# EasyEDA Pro project ProPrj_CYT4BB7CE_2026-05-09.epro

# Board PCB1
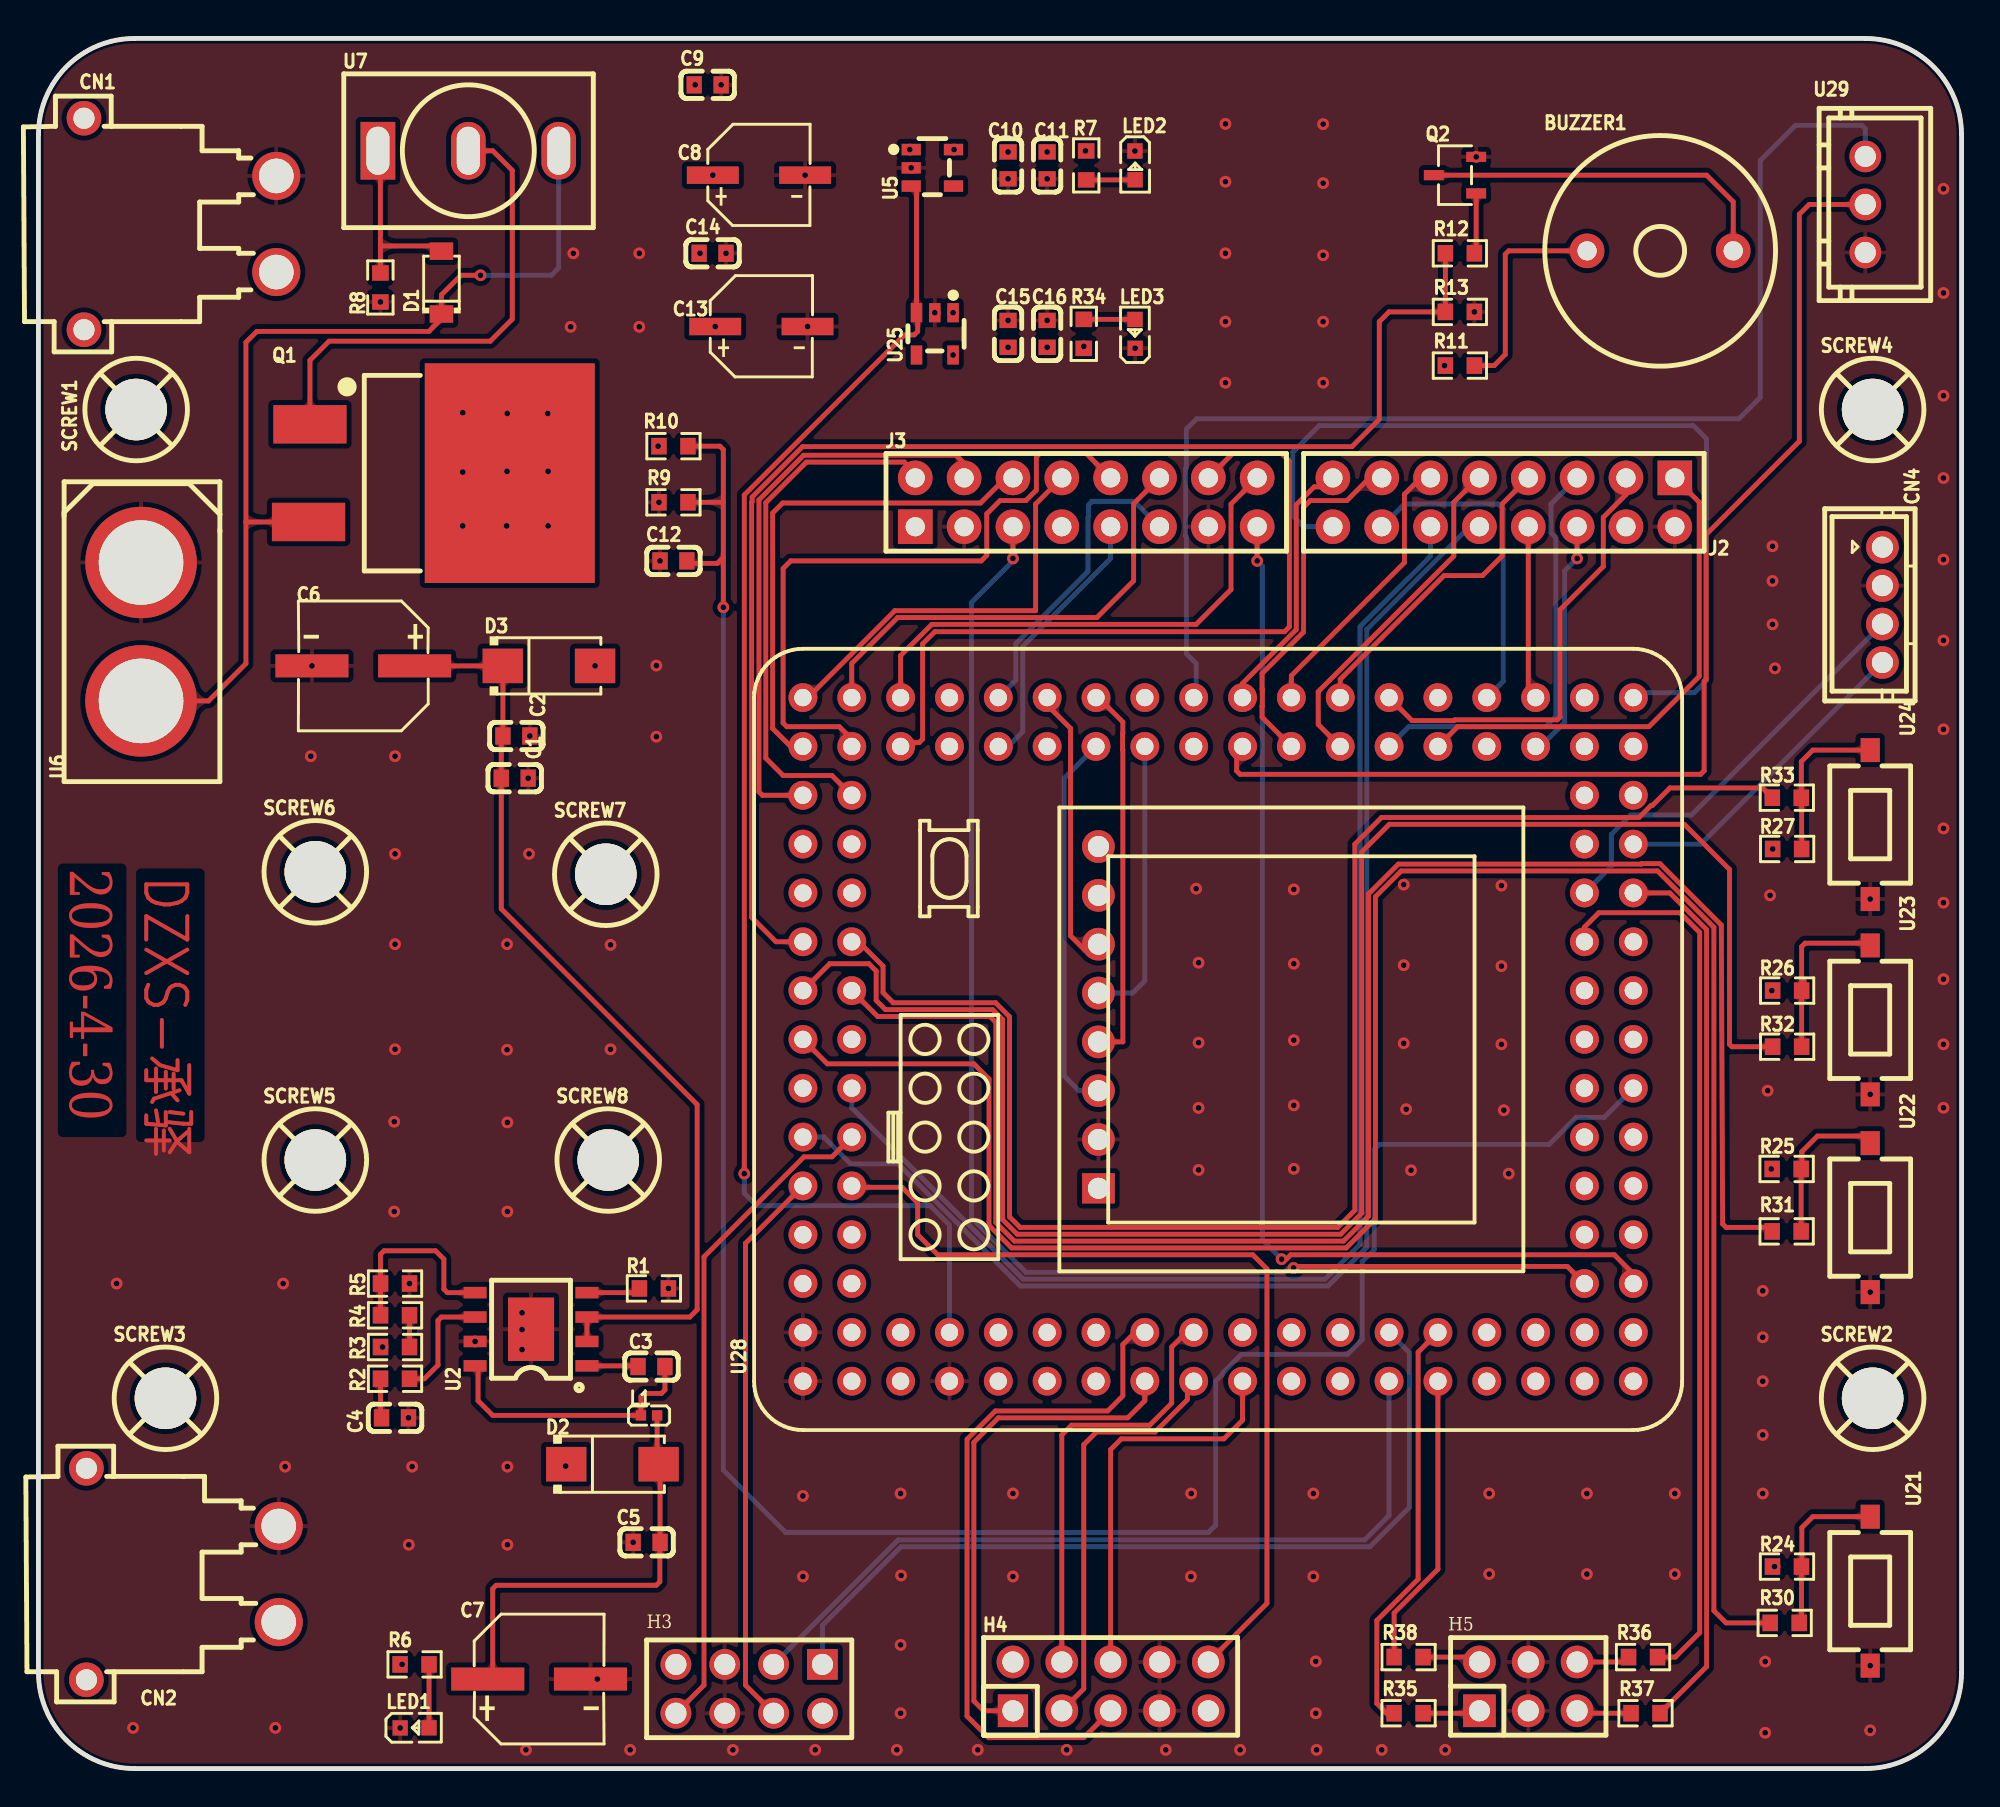
[diagram p0: board, top side]
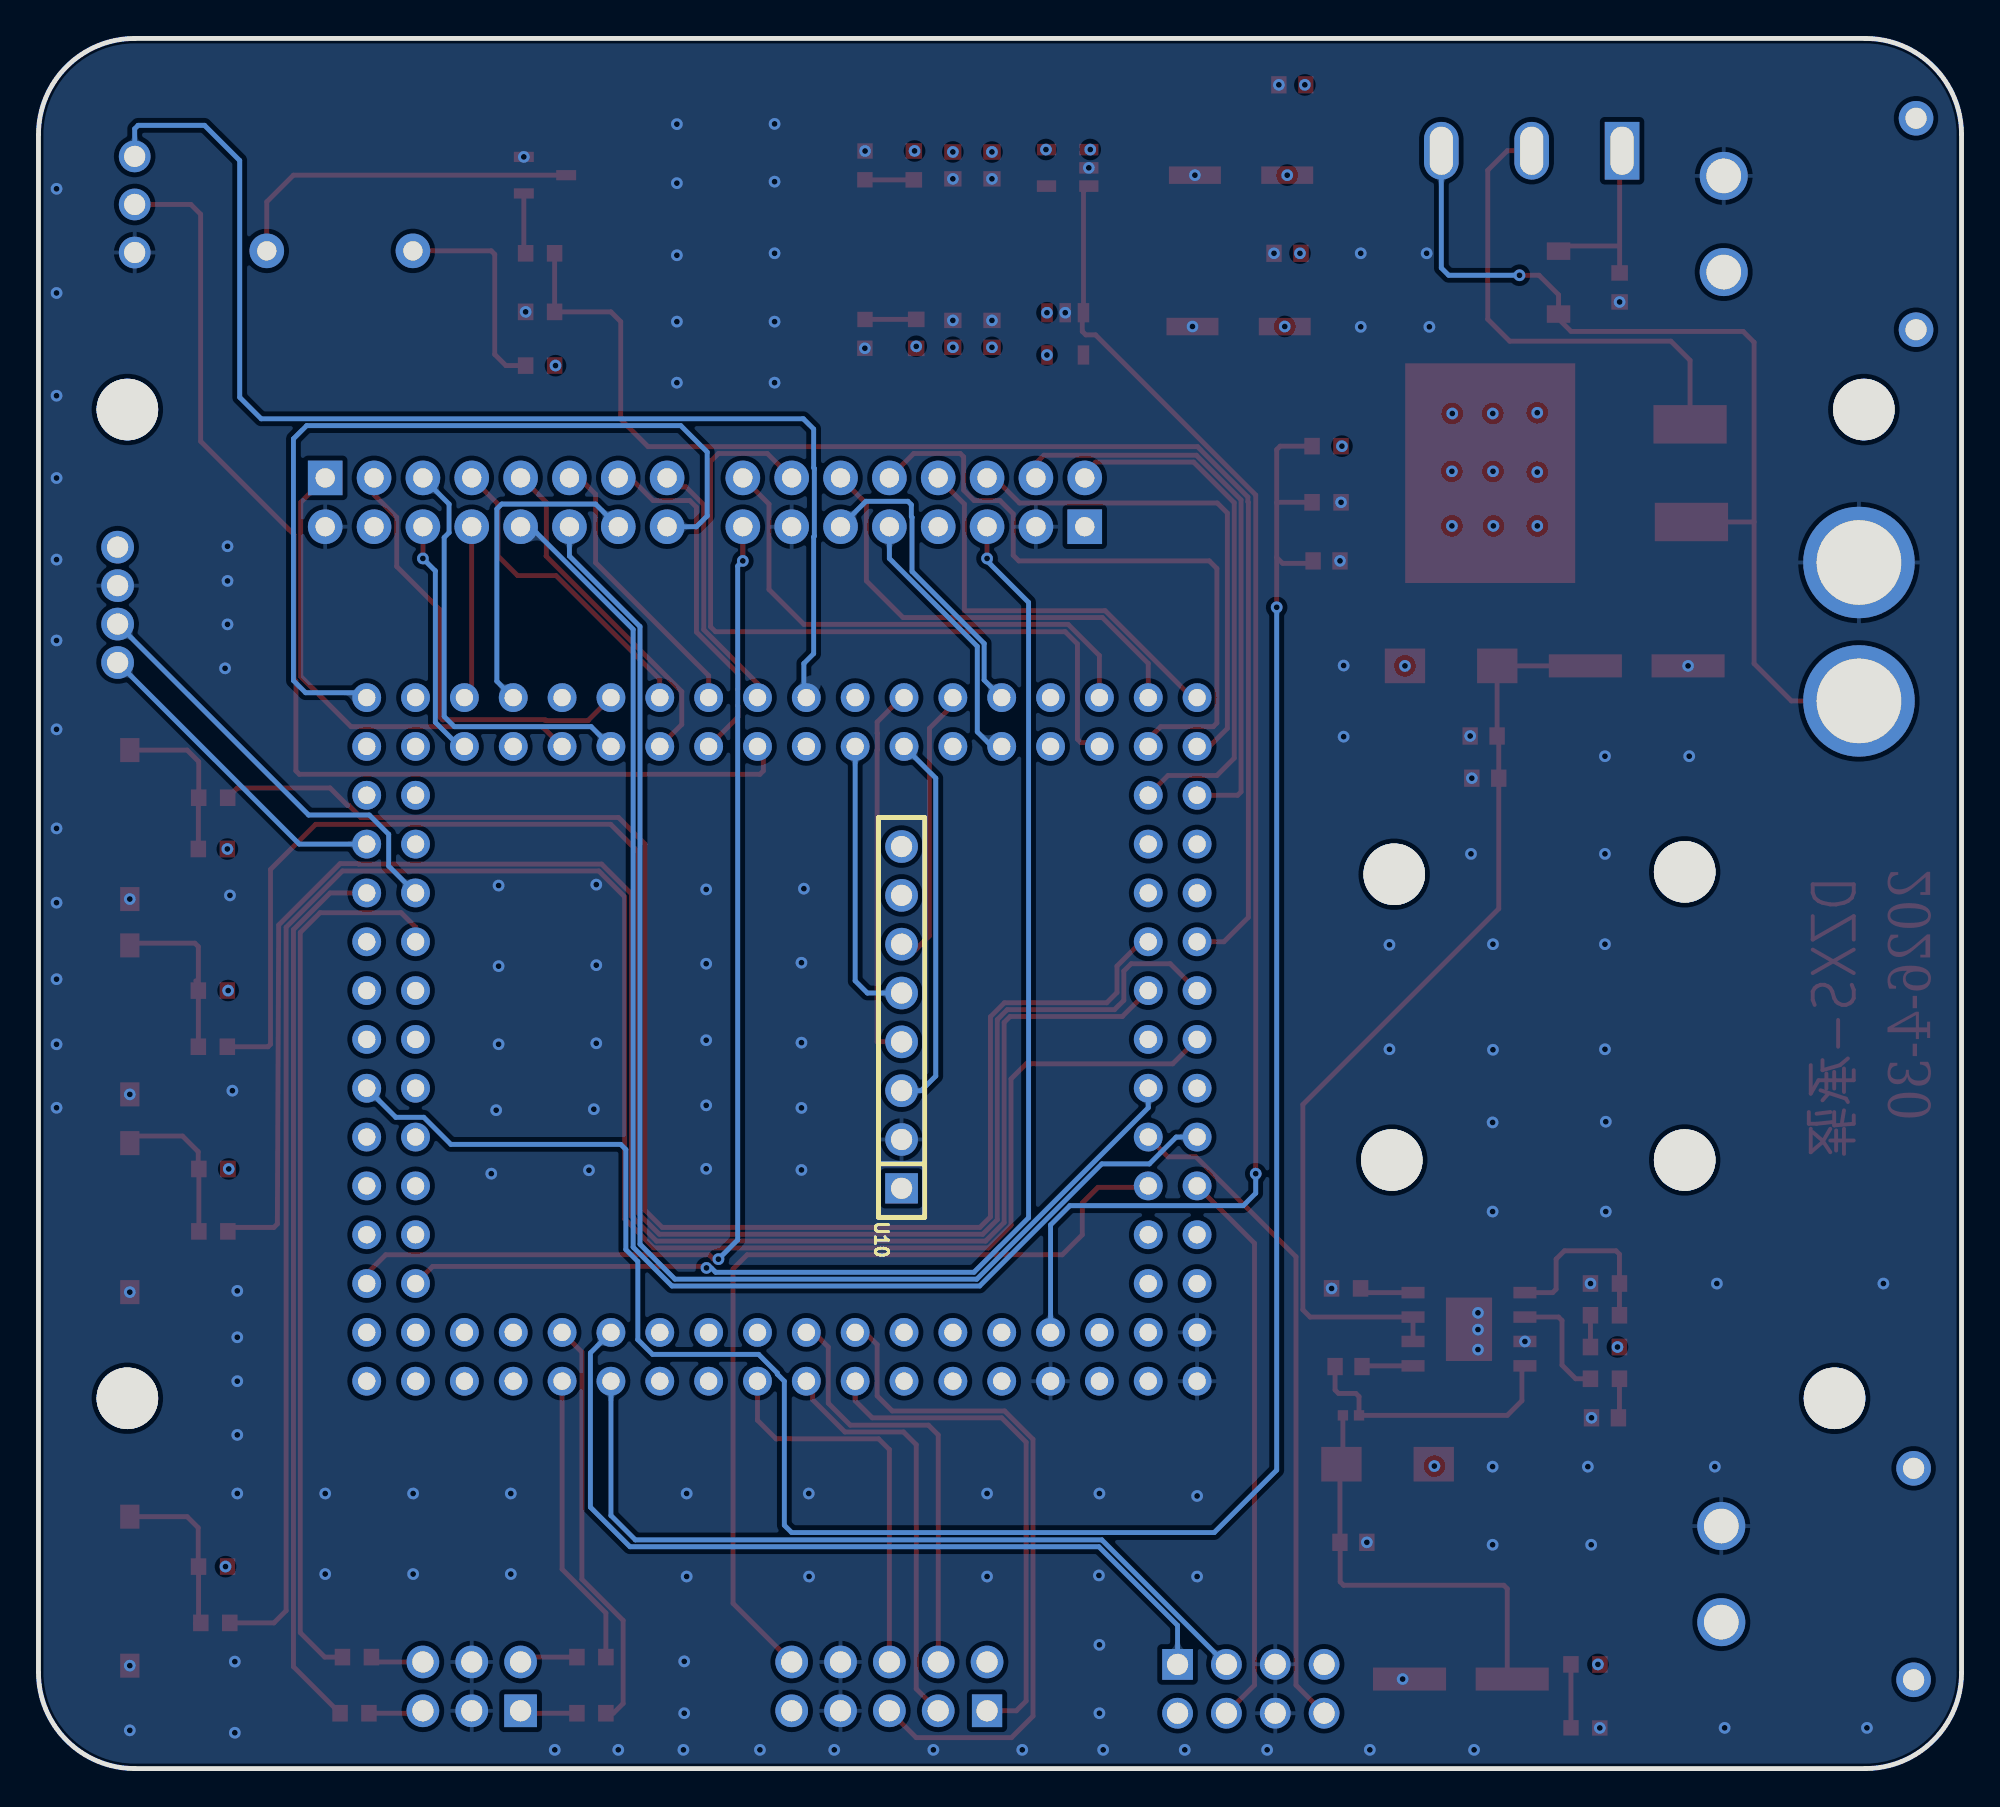
[diagram p1: board, bottom side, seen from below]

Outline 100 x 90 mm; copper layers: Top Layer, Inner1, Inner2, Bottom Layer. Coordinates in mm from the lower left corner of the outline.
Outline path: 0,85 0,5 arc(1.46,1.46) 5,0 95,0 arc(98.54,1.46) 100,5 100,85 arc(98.54,88.54) 95,90 5,90 arc(1.46,88.54) 0,85
Stack: Top Layer 0.035mm 外层铜厚1oz / Dielectric1 0.2104mm 7628 RC49% 8.6mil / Inner1 0.0152mm 内层铜厚 / Dielectric2 1.065mm 1.1mm H/HOZ Copper / Inner2 0.0152mm 内层铜厚 / Dielectric3 0.2104mm 7628 RC49% 8.6mil / Bottom Layer 0.035mm 外层铜厚1oz

## Design rules (mm)
template: JLCPCB Capability(Two Layers Board)
spacing copperThickness1oz (default): track to track 0.102, other pairs 0.152 to 0.3
spacing copperThickness2oz: track to track 0.203, other pairs 0.152 to 0.3
track width copperThickness1oz (default): min 0.127, default 0.254, max 2.54
track width copperThickness2oz: min 0.203, default 0.254, max 2.54
differential pair differentialPair (default): width min 0.127, default 0.254, max 2.54; gap min 0.152, default 0.152
via viaSize (default): diameter min 0.5, default 0.61, max 10; hole min 0.3, default 0.305, max 6.3

## Placement (name value [footprint] x y rotation side)
BUZZER1  2.3kHz  [BUZ-TH_BD12.0-P7.60-D0.6-FD]  84.33 78.95 0 top
C1  4.7uF  [C0603]  24.77 51.52 180 top
C2  100nF  [C0603]  24.85 53.71 180 top
C3  100nF  [C0603]  31.88 20.91 180 top
C4  4.7nF  [C0603]  18.54 18.25 0 top
C5  47uF  [C0603]  31.62 11.77 180 top
C6  100uF  [CAP-SMD_BD6.3-L6.6-W6.6-FD-1]  16.89 57.36 180 top
C7  220uF  [CAP-SMD_BD6.3-L6.6-W6.6-FD-1]  26.03 4.66 0 top
C8  10uF  [C_Ele_SMD_5x5.4mm]  37.47 82.89 0 top
C9  100nF  [C0603]  34.8 87.59 0 top
C10  10uF  [C0603]  50.42 83.4 270 top
C11  100nF  [C0603]  52.45 83.4 270 top
C12  100nF  [C0603]  33.02 62.82 0 top
C13  10uF  [C_Ele_SMD_5x5.4mm]  37.59 75.01 0 top
C14  100nF  [C0603]  35.05 78.82 0 top
C15  10uF  [C0603]  50.42 74.63 90 top
C16  100nF  [C0603]  52.45 74.63 90 top
CN1  XT30PW-M30.G.Y  [CONN-TH_XT30PW-M]  7.37 80.35 270 top
CN2  XT30PW-M30.G.Y  [CONN-TH_XT30PW-M]  7.49 10.12 270 top
CN4  WAFER-PH2.0-4PZZ  [CONN-TH_4P-P2.00_FWF20001-S04S22W5B]  95.88 60.54 270 top
D1  BZT52C16  [SOD-123_L2.7-W1.6-LS3.7-RD]  20.95 77.3 90 top
D2  SS54  [SMA_L4.2-W2.6-LS5.1-RD]  29.84 15.83 0 top
D3  SS54  [SMA_L4.2-W2.6-LS5.1-RD]  26.54 57.36 0 top
H3  DS1023-2*4SF11  [HDR-TH_8P-P2.54-V-F-R2-C4-S2.54]  36.96 4.15 180 top
H4  PM254V-12-10P-H85  [HDR-TH_10P-P2.54-V-F-R2-C5-S2.54]  55.75 4.28 0 top
H5  PZ254V-12-6P  [HDR-TH_6P-P2.54-V-M-R2-C3-S2.54]  77.47 4.28 0 top
J2  2.54-2*8P母  [HDR-TH_16P-P2.54-V-F-R2-C8-S2.54]  76.2 65.87 180 top
J3  2.54-2*8P母  [HDR-TH_16P-P2.54-V-F-R2-C8-S2.54]  54.48 65.87 0 top
L1  10uH  [L0402]  31.75 18.37 0 top
LED1  XL-1608UBC-04  [LED0603-RD_BLUE]  19.56 2.12 0 top
LED2  XL-1608UBC-04  [LED0603-RD_BLUE]  57.02 83.4 270 top
LED3  XL-1608UBC-04  [LED0603-RD_BLUE]  57.02 74.63 90 top
Q1  HY19P03B  [TO-263-2_L10.0-W9.1-P5.08-LS15.2-BR]  19.28 67.39 180 top
Q2  S8050  [SOT-23-3_L3.0-W1.7-P0.95-LS2.9-BR]  73.66 82.89 0 top
R1  200K  [R0603]  32 24.98 180 top
R2  20K  [R0603]  18.54 20.28 180 top
R3  51K  [R0603]  18.54 21.93 0 top
R4  1.5K  [R0603]  18.54 23.58 180 top
R5  10K  [R0603]  18.54 25.23 0 top
R6  4.7K  [R0603]  19.56 5.42 0 top
R7  2.7K  [R0603]  54.48 83.4 270 top
R8  10K  [R0603]  17.78 77.05 90 top
R9  20K  [R0603]  33.02 65.87 0 top
R10  200K  [R0603]  33.02 68.79 180 top
R11  10Ω  [R0603]  73.91 72.98 0 top
R12  4.7kΩ  [R0603]  73.91 78.82 0 top
R13  1kΩ  [R0603]  73.91 75.78 0 top
R24  4.7kΩ  [R0603]  90.92 10.51 0 top
R25  4.7kΩ  [R0603]  90.91 31.19 0 top
R26  4.7kΩ  [R0603]  90.93 40.47 0 top
R27  4.7kΩ  [R0603]  90.93 47.84 0 top
R30  470Ω  [R0603]  90.81 7.58 180 top
R31  470Ω  [R0603]  90.91 27.94 180 top
R32  470Ω  [R0603]  90.93 37.55 180 top
R33  470Ω  [R0603]  90.91 50.5 180 top
R34  2.7K  [R0603]  54.36 74.63 90 top
R35  100Ω  [R0603]  71.25 2.88 0 top
R36  100Ω  [R0603]  83.44 5.8 0 top
R37  100Ω  [R0603]  83.57 2.88 0 top
R38  100Ω  [R0603]  71.25 5.8 0 top
SCREW1  -  [M3螺丝]  5.08 70.7 0 top
SCREW2  -  [M3螺丝]  95.38 19.26 0 top
SCREW3  -  [M3螺丝]  6.6 19.26 0 top
SCREW4  -  [M3螺丝]  95.38 70.7 0 top
SCREW5  -  [M3螺丝]  14.4 31.66 0 top
SCREW6  -  [M3螺丝]  14.4 46.65 0 top
SCREW7  -  [M3螺丝]  29.5 46.52 0 top
SCREW8  -  [M3螺丝]  29.63 31.66 0 top
U2  SCT2450CQSTER  [ESOP-8_L4.9-W3.9-P1.27-LS6.0-BL-EP]  25.61 22.85 90 top
U5  RT9013-33GB-JSM  [SOT-23-5_L2.9-W1.6-P0.95-LS2.8-BR]  46.48 83.27 180 top
U6  XT60-M.  [CONN-TH_XT60]  5.33 59.14 270 top
U7  MT-0-102-A101-M200-RS  [SW-TH_MT-0-103-A101-M200-RS]  22.35 84.16 0 top
U10  PM254-1-08-Z-8.5  [HDR-TH_8P-P2.54-V-F]  55.12 39.07 90 bottom
U21  GT-TC060A-H025-L1  [SW-SMD_L6.1-W3.5-LS8.0]  95.25 9.23 270 top
U22  GT-TC060A-H025-L1  [SW-SMD_L6.1-W3.5-LS8.0]  95.25 28.66 270 top
U23  GT-TC060A-H025-L1  [SW-SMD_L6.1-W3.5-LS8.0]  95.25 38.95 270 top
U24  GT-TC060A-H025-L1  [SW-SMD_L6.1-W3.5-LS8.0]  95.25 49.11 270 top
U25  RT9013-33GB-JSM  [SOT-23-5_L2.9-W1.6-P0.95-LS2.8-BR]  46.61 74.63 90 top
U28  -  [CYT4BB7CEx_CoreBoard_V1.x]  65.15 37.93 90 top
U29  XH2.54-3P 直插  [CONN-TH_XH2.54-3P]  95 81.36 90 top

## Footprints (pads in the part's own frame, mm; a bottom-side part is the same pattern mirrored in y, then rotated)
BUZ-TH_BD12.0-P7.60-D0.6-FD
  round 1.8 hole 1: 1(-3.8,0) 2(3.8,0)
C0603
  rect 0.8x0.9 smd: 1(-0.7,0) 2(0.7,0)
C_Ele_SMD_5x5.4mm
  rect 2.7x0.91 smd: 1(-2.4,0) 2(2.4,0)
CAP-SMD_BD6.3-L6.6-W6.6-FD-1
  rect 3.8x1.2 smd: 1(-2.67,0) 2(2.67,0)
CONN-TH_4P-P2.00_FWF20001-S04S22W5B
  round 1.7 hole 1.1: 1(-3,0) 2(-1,0) 3(1,0) 4(3,0)
CONN-TH_XH2.54-3P
  round 1.65 hole 1.1: 1(-2.5,0) 2(0,0) 3(2.5,0)
CONN-TH_XT30PW-M
  round 2.5 hole 1.8: 1(-2.5,5) 2(2.5,5)
  round 1.8 hole 1.1: 3(5.5,-5) 4(-5.5,-5)
CONN-TH_XT60
  round 5.8 hole 4.4: 1(-3.6,0) 2(3.6,0)
CYT4BB7CEx_CoreBoard_V1.x
  round 1.5 hole 0.9: 1(-17.78,25.4) 2(-15.24,25.4) 3(-17.78,22.86) 4(-15.24,22.86) 5(-17.78,20.32) 6(-15.24,20.32) 7(-17.78,17.78) 8(-15.24,17.78) 9(-17.78,15.24) 10(-15.24,15.24) 11(-17.78,12.7) 12(-15.24,12.7) 13(-17.78,10.16) 14(-15.24,10.16) 15(-17.78,7.62) 16(-15.24,7.62) 17(-17.78,5.08) 18(-15.24,5.08) 19(-17.78,2.54) 20(-15.24,2.54) 21(-17.78,0) 22(-15.24,0) 23(-17.78,-2.54) 24(-15.24,-2.54) 25(-17.78,-5.08) 26(-15.24,-5.08) 27(-17.78,-7.62) 28(-15.24,-7.62) 29(-17.78,-10.16) 30(-15.24,-10.16) 31(-17.78,-12.7) 32(-15.24,-12.7) 33(-17.78,-15.24) 34(-15.24,-15.24) 35(-17.78,-17.78) 36(-15.24,-17.78) 37(-12.7,-17.78) 38(-12.7,-15.24) 39(-10.16,-17.78) 40(-10.16,-15.24) 41(-7.62,-17.78) 42(-7.62,-15.24) 43(-5.08,-17.78) 44(-5.08,-15.24) 45(-2.54,-17.78) 46(-2.54,-15.24) 47(0,-17.78) 48(0,-15.24) 49(2.54,-17.78) 50(2.54,-15.24) 51(5.08,-17.78) 52(5.08,-15.24) 53(7.62,-17.78) 54(7.62,-15.24) 55(10.16,-17.78) 56(10.16,-15.24) 57(12.7,-17.78) 58(12.7,-15.24) 59(17.78,-17.78) 60(15.24,-17.78) 61(17.78,-15.24) 62(15.24,-15.24) 63(17.78,-12.7) 64(15.24,-12.7) 65(17.78,-10.16) 66(15.24,-10.16) 67(17.78,-7.62) 68(15.24,-7.62) 69(17.78,-5.08) 70(15.24,-5.08) 71(17.78,-2.54) 72(15.24,-2.54) 73(17.78,0) 74(15.24,0) 75(17.78,2.54) 76(15.24,2.54) 77(17.78,5.08) 78(15.24,5.08) 79(17.78,7.62) 80(15.24,7.62) 81(17.78,10.16) 82(15.24,10.16) 83(17.78,12.7) 84(15.24,12.7) 85(17.78,15.24) 86(15.24,15.24) 87(17.78,17.78) 88(15.24,17.78) 89(17.78,20.32) 90(15.24,20.32) 91(17.78,22.86) 92(15.24,22.86) 93(17.78,25.4) 94(15.24,25.4) 95(12.7,25.4) 96(12.7,22.86) 97(10.16,25.4) 98(10.16,22.86) 99(7.62,25.4) 100(7.62,22.86) 101(5.08,25.4) 102(5.08,22.86) 103(2.54,25.4) 104(2.54,22.86) 105(0,25.4) 106(0,22.86) 107(-2.54,25.4) 108(-2.54,22.86) 109(-5.08,25.4) 110(-5.08,22.86) 111(-7.62,25.4) 112(-7.62,22.86) 113(-10.16,25.4) 114(-10.16,22.86) 115(-12.7,25.4) 116(-12.7,22.86)
ESOP-8_L4.9-W3.9-P1.27-LS6.0-BL-EP
  rect 0.6x1.2 smd: 1(-1.905,-2.909) 2(-0.635,-2.909) 3(0.635,-2.909) 4(1.905,-2.909) 5(1.905,2.909) 6(0.635,2.909) 7(-0.635,2.909) 8(-1.905,2.909)
  rect 3.3x2.4 smd: 9(0,0)
HDR-TH_6P-P2.54-V-M-R2-C3-S2.54
  rect 1.7x1.7 hole 1.1: 1(-2.54,-1.27)
  round 1.7 hole 1.1: 2(-2.54,1.27) 3(0,-1.27) 4(0,1.27) 5(2.54,-1.27) 6(2.54,1.27)
HDR-TH_8P-P2.54-V-F
  rect 1.575x1.7 hole 1.1: 1(-8.89,0)
  round 1.7 hole 1.1: 2(-6.35,0) 3(-3.81,0) 4(-1.27,0) 5(1.27,0) 6(3.81,0) 7(6.35,0) 8(8.89,0)
HDR-TH_8P-P2.54-V-F-R2-C4-S2.54
  rect 1.6x1.6 hole 1.1: 1(-3.81,-1.27)
  round 1.6 hole 1.1: 2(-3.81,1.27) 3(-1.27,-1.27) 4(-1.27,1.27) 5(1.27,-1.27) 6(1.27,1.27) 7(3.81,-1.27) 8(3.81,1.27)
HDR-TH_10P-P2.54-V-F-R2-C5-S2.54
  rect 1.575x1.7 hole 1.1: 1(-5.08,-1.27)
  round 1.7 hole 1.1: 2(-5.08,1.27) 3(-2.54,-1.27) 4(-2.54,1.27) 5(0,-1.27) 6(0,1.27) 7(2.54,-1.27) 8(2.54,1.27) 9(5.08,-1.27) 10(5.08,1.27)
HDR-TH_16P-P2.54-V-F-R2-C8-S2.54
  rect 1.8x1.8 hole 1: 1(-8.89,-1.27)
  round 1.8 hole 1: 2(-8.89,1.27) 3(-6.35,-1.27) 4(-6.35,1.27) 5(-3.81,-1.27) 6(-3.81,1.27) 7(-1.27,-1.27) 8(-1.27,1.27) 9(1.27,-1.27) 10(1.27,1.27) 11(3.81,-1.27) 12(3.81,1.27) 13(6.35,-1.27) 14(6.35,1.27) 15(8.89,-1.27) 16(8.89,1.27)
L0402
  rect 0.54x0.54 smd: 1(-0.42,0) 2(0.42,0)
LED0603-RD_BLUE
  rect 0.8x0.8 smd: 1(-0.749,-0.004) 2(0.749,0.004)
M3螺丝
  round 3.2 hole 3.2: 1(0,0)
R0603
  rect 0.806x0.864 smd: 1(-0.753,0) 2(0.753,0)
SMA_L4.2-W2.6-LS5.1-RD
  rect 2.1x1.8 smd: 1(-2.4,0) 2(2.4,0)
SOD-123_L2.7-W1.6-LS3.7-RD
  rect 0.91x1.22 smd: 1(-1.635,0) 2(1.635,0)
SOT-23-3_L3.0-W1.7-P0.95-LS2.9-BR
  rect 1.038x0.532 smd: 1(1.101,-0.95) 2(1.101,0.95) 3(-1.101,0)
SOT-23-5_L2.9-W1.6-P0.95-LS2.8-BR
  rect 1x0.6 smd: 1(1.1,-0.95) 2(1.1,0) 3(1.1,0.95) 4(-1.1,0.95) 5(-1.1,-0.95)
SW-SMD_L6.1-W3.5-LS8.0
  rect 1.25x1 smd: 1(-3.875,0) 2(3.875,0)
SW-TH_MT-0-103-A101-M200-RS
  rect 1.8x3 hole 1.2x2.5: 1(-4.7,0)
  oval 1.8x3 hole 1.2x2.5: 2(0,0) 3(4.7,0)
TO-263-2_L10.0-W9.1-P5.08-LS15.2-BR
  rect 3.81x2 smd: 1(5.16,-2.54) 3(5.231,2.54)
  rect 8.84x11.43 smd: 4(-5.231,0)

## Nets
GND: C1.1 C2.1 C4.2 C5.2 C6.2 C7.2 C8.2 C9.2 C10.2 C11.2 C12.1 C13.2 C14.2 C15.2 C16.2 CN1.1 CN2.1 CN4.2 H3.5 H3.6 H4.7 H4.8 H5.3 H5.4 J2.2 J3.3 J3.13 LED1.1 LED2.1 LED3.1 Q2.2 R1.1 R5.2 R8.1 R9.1 R13.2 U2.7 U2.9 U5.2 U6.1 U10.2 U21.2 U22.2 U23.2 U24.2 U25.2 U28.1 U28.2 U28.7 U29.1
VCC3V3: C10.1 C11.1 J2.4 R7.1 R11.1 R24.1 R25.1 R26.1 R27.1 U5.5 U10.1
VCC5V: C8.1 C9.1 C13.1 C14.1 CN4.1 D2.1 H3.7 H4.9 R3.1 R6.1 U5.1 U25.1 U28.5 U28.6
VCCBAT: CN1.2 CN2.2 D3.2 Q1.4 R10.2
VCCCAM: C15.1 C16.1 J3.1 R34.1 U25.5
0.3: U28.12
1.0: U28.13
1.1: U28.14
2.0: H4.1 U28.15
2.1: H4.5 U28.16
2.2: H4.3 U28.17
2.3: H4.4 U28.18
2.4: H4.6 U28.19
4.0: H3.3 U28.25
4.1: H3.1 U28.26
5.0: R38.1 U28.27
5.1: R35.1 U28.28
5.2: U28.29
5.3: U28.30
6.0: U28.32
6.1: U28.33
6.2: U28.34
6.3: U28.35
6.4: U28.36
6.5: J3.15 U28.37
6.6: J3.5 U28.38
6.7: U28.39
7.2: U28.42
7.3: U28.43
7.4: U28.44
7.5: C12.2 R9.2 R10.1 U28.45
7.6: U28.46
7.7: U28.47
8.1: U28.49
8.2: U28.50
9.0: R36.2 U28.52
9.1: R37.2 U28.53
10.0: CN4.3 U28.54
10.1: CN4.4 U28.55
10.2: U28.56
10.3: U28.57
10.4: U28.58
11.0: J2.16 U28.59
12.0: U28.62
12.1: J2.8 U28.63
12.2: J2.6 U28.64
12.3: J2.14 U28.65
12.4: U28.66
12.5: U28.67
13.0: J2.1 U28.68
13.1: J2.3 U28.69
13.2: J2.5 U28.70
13.3: J2.7 U28.71
13.4: J2.9 U28.72
13.5: J2.11 U28.73
13.6: J2.13 U28.74
13.7: J2.15 U28.75
14.0: U28.76 U29.2
14.1: U28.77 U29.3
14.4: U28.78
14.5: U28.79
15.0: U10.5 U28.80
15.1: U10.4 U28.81
15.2: U10.3 U28.82
15.3: U10.6 U28.83
17.1: J3.11 U28.85
17.2: J3.9 U28.86
17.3: U28.87
17.4: U28.88
18.0: J3.16 U28.89
18.1: J3.14 U28.90
18.2: J3.12 U28.91
18.3: J3.10 U28.92
18.4: J3.8 U28.93
18.5: J3.6 U28.94
18.6: J3.4 U28.95
18.7: J3.2 U28.96
19.0: U28.97
19.1: U28.98
19.2: U28.99
19.3: U28.100
19.4: R12.1 R13.1 U28.101
20.0: R33.2 U28.102
20.1: R32.2 U28.103
20.2: R31.2 U28.104
20.3: R30.2 U28.105
21.5: U28.106
21.6: U28.107
22.3: J2.12 U28.108
22.4: J2.10 U28.109
22.5: H3.8 U28.110
22.6: H3.4 U28.111
23.0: H4.10 U28.112
CR: U5.3 U25.3 U28.8
$1N2993: C1.2 C2.2 C6.1 D3.1 U2.2 U2.3
$1N3021: R1.2 U2.4
$1N3084: C4.1 R2.2
$1N3089: C3.2 U2.1
$1N3099: C3.1 L1.1 U2.8
$1N3104: C5.1 C7.1 D2.2 L1.2
$1N3116: R2.1 U2.6
$1N3207: R3.2 R4.1
$1N3215: R4.2 R5.1 U2.5
$1N3242: LED1.2 R6.2
$1N3695: LED2.2 R7.2
$1N4280: D1.1 Q1.3 U6.2 U7.3
$1N4292: D1.2 R8.2 U7.1
$1N4319: Q1.1 U7.2
$1N5131: BUZZER1.1 R11.2
$1N5132: BUZZER1.2 Q2.3
$1N5133: Q2.1 R12.2
$1N6075: R24.2 R30.1 U21.1
$1N6078: R25.2 R31.1 U22.1
$1N6081: R26.2 R32.1 U23.1
$1N6084: R27.2 R33.1 U24.1
$1N6374: LED3.2 R34.2
$1N7088: H5.2 R38.2
$1N7091: H5.5 R37.1
$1N7092: H5.6 R36.1
$1N7095: H5.1 R35.2

Pads without a net: CN1 3 4; CN2 3 4; H3 2; H4 2; J3 7; SCREW1 1; SCREW2 1; SCREW3 1; SCREW4 1; SCREW5 1; SCREW6 1; SCREW7 1; SCREW8 1; U5 4; U10 7 8; U25 4; U28 3 4 9 10 11 20 21 22 23 24 31 40 41 48 51 60 61 84 113 114 115 116

## Via types
v1: diameter 0.61, hole 0.305, Top Layer to Bottom Layer, 192 vias

## Routing (per net, layer and track width the routed paths; a pad name or vN(x,y) marks a point on that pad's centre or on a via; arc(x,y) is an arc through that point)
GND:
  vias: v1(4.06,25.23) v1(4.92,2.12) v1(12.32,2.12) v1(12.72,25.23) v1(12.83,15.71) v1(14.22,57.36) v1(14.16,52.66) v1(17.78,76.29) v1(18.54,52.66) v1(18.54,47.58) v1(18.54,42.88) v1(18.54,37.42) v1(18.5,33.65) v1(18.5,28.98) v1(18.81,2.11) v1(19.24,18.25) v1(19.3,25.23) v1(19.26,11.64) v1(19.43,15.71) v1(22.7,22.22) v1(24.37,42.88) v1(24.37,37.39) v1(24.38,33.61) v1(24.38,28.98) v1(24.38,15.71) v1(24.38,11.64) v1(25.15,23.71) v1(25.15,22.83) v1(25.15,21.79) v1(25.35,0.97) v1(25.47,51.52) v1(25.51,47.58) v1(25.55,53.71) v1(27.67,75) v1(27.81,78.82) v1(29.06,4.66) v1(29.75,42.85) v1(29.75,37.42) v1(30.77,0.97) v1(30.92,11.77) v1(31.24,78.82) v1(31.24,75) v1(32.13,57.38) v1(32.13,53.68) v1(32.27,65.87) v1(32.32,62.82) v1(32.76,24.98) v1(35.5,87.59) v1(35.75,78.82) v1(36.11,0.97) v1(39.75,14.18) v1(39.75,9.99) v1(39.87,82.89) v1(39.99,75.01) v1(40.39,0.97) v1(44.64,0.97) v1(44.83,14.31) v1(44.83,6.43) v1(44.83,2.88) v1(44.86,10.04) v1(45.38,83.27) v1(46.61,75.73) v1(48.84,0.97) v1(50.42,82.7) v1(50.42,75.33) v1(50.67,14.31) v1(50.67,9.99) v1(52.45,82.7) v1(52.45,75.33) v1(53.47,0.97) v1(57.02,84.15) v1(57.03,73.88) v1(58.62,0.97) v1(59.94,14.31) v1(59.93,9.99) v1(60.2,45.77) v1(60.32,41.92) v1(60.32,37.76) v1(60.32,34.37) v1(60.32,31.14) v1(61.72,85.56) v1(61.72,82.55) v1(61.72,78.82) v1(61.72,75.27) v1(61.72,72.09) v1(62.48,0.97) v1(65.28,45.73) v1(65.28,41.87) v1(65.28,37.89) v1(65.28,34.5) v1(65.28,31.2) v1(66.29,14.31) v1(66.29,9.99) v1(66.42,5.58) v1(66.42,2.88) v1(66.46,0.97) v1(66.8,85.54) v1(66.8,82.47) v1(66.8,78.72) v1(66.8,75.27) v1(66.8,72.09) v1(69.85,0.97) v1(70.99,45.98) v1(70.99,41.79) v1(70.99,37.73) v1(71.12,34.3) v1(71.37,31.12) v1(73.15,0.97) v1(74.67,75.78) v1(74.76,83.84) v1(75.44,14.31) v1(75.44,10.12) v1(76.07,45.93) v1(76.07,41.74) v1(76.07,37.68) v1(76.2,34.25) v1(76.45,30.95) v1(80.52,14.31) v1(80.52,10.12) v1(85.09,14.31) v1(85.09,10.12) v1(89.66,24.85) v1(89.66,22.44) v1(89.66,20.15) v1(89.66,17.36) v1(89.66,14.31) v1(89.79,5.56) v1(89.79,1.86) v1(89.92,35.26) v1(90.04,45.42) v1(90.17,63.58) v1(90.17,61.78) v1(90.17,59.52) v1(90.3,57.23) v1(95.25,45.23) v1(95.25,35.07) v1(95.25,24.78) v1(95.25,5.35) v1(95.25,1.99) v1(99.06,82.18) v1(99.06,76.76) v1(99.06,71.42) v1(99.06,67.13) v1(99.06,62.89) v1(99.06,58.68) v1(99.06,54.06) v1(99.06,48.91) v1(99.06,45.04) v1(99.06,41.06) v1(99.06,37.68) v1(99.06,34.37)
VCC3V3:
  vias: v1(47.61,84.22) v1(50.42,84.1) v1(52.45,84.1) v1(54.44,84.15) v1(73.11,72.98) v1(90.14,40.47) v1(90.11,31.19) v1(90.18,47.84) v1(90.27,10.51)
VCC5V: length 142.7
  Inner2 w0.254: 45.31,86.54 v1(45.31,84.22)
  Inner2 w1.524: 45.31,86.54 46.74,87.97 88.39,87.97 90.93,85.43 90.93,65.87 93.27,63.54 CN4.1 ; U28.5 44.83,18.37 44.45,17.99 38.48,17.99 33.98,22.5 33.98,65.43 35.19,66.65 v1(35.19,75.01)
  vias: v1(17.89,21.93) v1(18.91,5.42) v1(27.41,15.74) v1(34.15,87.59) v1(34.4,78.82) v1(35.06,82.89) v1(47.56,75.73)
VCCBAT: length 106.1
  Inner2 w1.524: CN1.2 15.2,75.01 19.94,75.01 23.75,71.2 23.75,71.12 v1(24.38,70.49) ; CN2.2 15.41,7.62 16.89,9.1 16.89,14.56 11.68,19.77 11.68,23.58 6.22,29.04 6.22,36.79 9.45,40.01 20.12,40.01 22.61,42.5 22.61,56.35 22.79,56.52 28.11,56.52 v1(28.94,57.36) 28.94,62.2 v1(26.5,64.64) ; v1(32.22,68.79) 27.81,68.79 v1(26.5,67.48)
  vias: v1(22.06,70.53) v1(22.06,67.44) v1(22.06,64.64) v1(24.35,64.64) v1(24.36,67.48) v1(26.48,70.49)
VCCCAM: length 31.6
  Inner2 w1.524: 50.44,71.33 52.47,71.33 ; 50.44,71.33 47.37,71.33 ; 50.44,71.33 50.42,71.36 v1(50.42,73.93) ; 52.47,71.33 52.45,71.35 v1(52.45,73.93) ; 52.47,71.33 54.36,71.33 54.54,71.51 54.54,73.8 v1(54.36,73.98) ; 47.37,71.33 47.56,71.52 v1(47.56,73.53) ; 47.37,71.33 43.94,71.33 41.98,69.37 41.98,65.03 42.16,64.85 45.34,64.85 45.59,64.6
2.0: length 26.5
  Top Layer w0.254: 50.67,3.01 49.15,3.01 48.64,3.51 48.64,16.98 49.91,18.25 56.64,18.25 57.53,19.13 U28.15
2.1: length 36
  Top Layer w0.254: 55.75,3.01 54.36,1.61 49.4,1.61 48.28,2.73 48.28,17.13 49.76,18.6 55.6,18.6 56.39,19.39 56.39,22.06 57.02,22.69 U28.16
2.2: length 21.8
  Top Layer w0.254: 53.21,3.01 54.36,4.15 54.36,16.85 55.02,17.51 58.06,17.51 59.74,19.19 59.74,19.82 U28.17
2.3: length 22.6
  Top Layer w0.254: U28.18 59.69,22.69 58.93,21.93 58.93,19.01 57.78,17.86 53.72,17.86 53.21,17.36 H4.4
2.4: length 20.6
  Top Layer w0.254: U28.19 62.61,18.12 61.65,17.15 56.31,17.15 55.75,16.59 H4.6
4.0: length 42.2
  Bottom Layer w0.254: H3.3 44.7,11.9 68.96,11.9 70.23,13.17 U28.25
4.1: length 44.6
  Bottom Layer w0.254: U28.26 71.3,21.62 71.3,13.6 69.24,11.54 44.86,11.54 40.77,7.45 H3.1
5.0: length 15.3
  Top Layer w0.254: U28.27 72.77,10.37 70.49,8.09 R38.1
5.1: length 21.7
  Top Layer w0.254: U28.28 71.74,21.66 71.74,9.85 69.6,7.7 69.6,3.39 70.1,2.88 R35.1
6.5: length 57.9
  Top Layer w0.254: J3.15 v1(63.37,62.82) ; U28.37 82.93,25.74 81.94,26.73 65.12,26.73 64.89,26.5 v1(64.64,26.5)
  Bottom Layer w0.254: v1(63.37,62.82) 63.64,62.56 63.64,27.5 v1(64.64,26.5)
6.6: length 70.3
  Top Layer w0.254: v1(65.26,26.04) 65.34,26.12 79.5,26.12 U28.38 ; J3.5 v1(50.67,62.95)
  Bottom Layer w0.254: 50.67,62.82 48.51,60.66 48.51,28.65 51.35,25.82 64.79,25.82 65.01,26.04 v1(65.26,26.04)
7.5: length 127
  Top Layer w0.254: R10.1 35.43,68.79 35.61,68.61 35.61,65.84 ; 35.61,65.84 35.61,63 ; 35.61,65.84 35.59,65.87 R9.2 ; 35.61,63 v1(35.61,60.41) ; 35.61,63 35.31,62.7 33.85,62.7 C12.2
  Bottom Layer w0.254: v1(35.61,60.41) 35.61,15.53 38.86,12.28 60.83,12.28 61.21,12.66 61.21,20.15 61.58,20.52 61.58,20.58 62.55,21.55 68.07,21.55 68.83,22.31 68.83,26.38 69.46,27 69.46,32.2 69.72,32.47 78.56,32.47 79.97,33.88 81.42,33.88 U28.45
9.0: length 46.6
  Top Layer w0.254: U28.52 80.39,43.77 81.14,44.52 85.36,44.52 86.38,43.49 86.38,7.07 85.12,5.8 R36.2
9.1: length 46.4
  Top Layer w0.254: U28.53 84.83,45.55 86.74,43.64 86.74,5.3 R37.2
10.0: length 22.3
  Bottom Layer w0.254: U28.54 81.79,46.95 81.79,48.6 82.79,49.6 85.95,49.6 CN4.3
10.1: length 16.9
  Bottom Layer w0.254: CN4.4 86.44,48.09 U28.55
11.0: length 44.8
  Bottom Layer w0.254: U28.59 83.19,55.96 86.11,55.96 86.74,56.6 86.74,69.17 86.05,69.86 66.6,69.86 65.23,68.48 65.23,65.16 65.79,64.6 J2.16
12.1: length 9
  Top Layer w0.254: J2.8 77.47,56.09 U28.63
12.2: length 12.5
  Top Layer w0.254: J2.6 v1(80.01,62.95)
  Bottom Layer w0.254: v1(80.01,62.95) 79.36,62.3 79.36,54.43 78.1,53.17 U28.64
12.3: length 17.1
  Bottom Layer w0.254: J2.14 71.03,65.78 75.91,65.78 76.16,65.53 76.16,56.56 U28.65
13.0: length 26
  Top Layer w0.254: U28.68 73.8,54.2 83.74,54.2 86.36,56.81 86.36,65.87 J2.1
13.1: length 23.3
  Top Layer w0.254: J2.3 82.55,66.27 81.37,65.09 81.37,62.53 79.12,60.28 79.12,54.69 78.98,54.56 73.65,54.56 73.61,54.51 71.43,54.51 U28.69
13.2: length 22.4
  Bottom Layer w0.254: U28.70 71.26,54.2 78.37,54.2 78.9,54.73 78.9,64.04 78.65,64.29 78.65,65.78 J2.5
13.3: length 16.7
  Top Layer w0.254: J2.7 76.11,65.78 76.11,63.08 75.09,62.06 73.09,62.06 67.69,56.66 U28.71
13.4: length 18
  Top Layer w0.254: J2.9 74.87,67.14 73.6,65.87 73.6,63.07 66.55,56.02 66.55,54.31 U28.72
13.5: length 14.7
  Top Layer w0.254: J2.11 71.88,67.14 71.03,66.29 71.03,62.73 65.15,56.85 U28.73
13.6: length 18.8
  Top Layer w0.254: J2.13 69.72,67.27 69.34,67.27 68.04,65.96 66.13,65.96 65.79,65.62 65.79,59.12 63.63,56.96 63.63,56.15 63.64,56.14 63.64,55.28 63.63,55.27 63.63,54.69 U28.74
13.7: length 13.7
  Top Layer w0.254: U28.75 62.61,56.45 65.41,59.25 65.41,65.74 66.34,66.67 66.84,66.67 J2.15
14.0: length 60.5
  Top Layer w0.254: U29.2 92.07,81.36 91.57,80.86 91.57,69.05 86.72,64.19 86.72,56.67 86.61,56.57 86.61,51.9 86.43,51.72 62.48,51.72 62.3,51.9 62.3,52.86 U28.76
14.1: length 64.8
  Bottom Layer w0.254: U28.77 60.2,55.84 60.2,57.49 59.69,58 59.69,64.08 59.65,64.11 59.65,67.63 59.69,67.66 59.69,69.68 60.23,70.22 88.42,70.22 89.53,71.33 89.53,83.65 91.37,85.48 94.82,85.48 95,85.3 U29.3
15.0: length 14.9
  Bottom Layer w0.254: U10.5 56.9,40.34 57.53,40.98 U28.80
15.1: length 19.8
  Top Layer w0.254: U28.81 55.12,55.71 56.39,54.44 56.39,53.86 56.38,53.85 56.38,53 56.39,52.99 56.39,37.8 U10.4
15.2: length 19.9
  Bottom Layer w0.254: U28.82 53.34,51.52 53.34,36.03 54.1,35.26 U10.3
15.3: length 14.8
  Top Layer w0.254: U10.6 54.79,42.55 54.43,42.55 53.67,43.32 53.67,54.11 52.45,55.33 U28.83
17.1: length 16.3
  Bottom Layer w0.254: J3.11 56.97,65.92 54.79,65.92 54.61,65.74 54.61,65.12 54.57,65.09 54.57,62.27 50.82,58.52 50.82,56.62 U28.85
17.2: length 14.1
  Bottom Layer w0.254: U28.86 50.42,53.17 51.18,53.93 51.18,58.38 55.75,62.95 J3.9
18.0: length 27.2
  Top Layer w0.254: J3.16 62.01,65.78 62.01,61.33 60.2,59.52 46.46,59.52 44.83,57.9 U28.89
18.1: length 39.2
  Top Layer w0.254: J3.14 62.1,68.41 64.64,68.41 65.05,68 65.05,59.39 64.79,59.14 46.61,59.14 45.97,58.5 45.97,53.55 45.79,53.37 45.03,53.37 U28.90
18.2: length 24.1
  Top Layer w0.254: U28.91 42.29,57.49 44.68,59.88 55.04,59.88 56.95,61.78 56.95,65.8 J3.12
18.3: length 34.6
  Top Layer w0.254: U28.92 42.29,53.55 41.64,54.2 38.91,54.2 38.72,54.39 38.72,62.43 39.12,62.82 49.02,62.82 49.31,63.11 49.31,65.27 50,65.96 51.35,65.96 51.89,66.51 51.89,68.23 52.07,68.41 54.48,68.41 J3.10
18.4: length 21.4
  Top Layer w0.254: U28.93 40.01,55.71 44.53,60.23 51.85,60.23 51.85,65.78 J3.8
18.5: length 26.4
  Top Layer w0.254: J3.6 50.29,67.14 48.99,65.83 38.7,65.83 38.18,65.31 38.18,54.11 39.12,53.17 U28.94
18.6: length 30.1
  Top Layer w0.254: J3.4 48.13,67.9 47.72,68.32 39.79,68.32 37.47,66 37.47,50.81 37.64,50.63 U28.95
18.7: length 27.7
  Top Layer w0.254: U28.96 41.26,51.66 38.72,51.66 37.82,52.56 37.82,65.85 39.93,67.96 45.02,67.96 45.59,67.39 45.59,67.14
19.4: length 71.1
  Top Layer w0.254: U28.101 38.35,43.01 37.08,44.28 37.08,65.87 37.11,65.9 37.11,66.14 39.73,68.77 68.3,68.77 69.72,70.19 69.72,75.27 70.23,75.78 R13.1 R12.1
20.0: length 81.8
  Top Layer w0.254: U28.102 42.65,43.01 43.92,41.74 43.92,40.37 44.45,39.84 49.77,39.84 50.5,39.11 50.5,28.7 51.05,28.15 67.56,28.15 68.45,29.04 68.45,48.09 69.84,49.48 83.23,49.48 83.87,50.11 83.93,50.11 84.84,51.01 89.65,51.01 90.16,50.5
20.1: length 93.8
  Top Layer w0.254: R32.2 88.06,37.55 87.93,37.68 87.93,46.77 85.59,49.12 70.24,49.12 68.81,47.68 68.81,28.89 67.71,27.79 50.9,27.79 50.14,28.55 50.14,38.96 49.62,39.48 44.04,39.48 43.56,39.96 43.56,41.49 43.18,41.87 41.15,41.87 U28.103
20.2: length 94.3
  Top Layer w0.254: R31.2 89.94,28.15 87.76,28.15 87.58,28.33 87.51,43.88 84.31,47.07 83.37,47.07 83.34,47.05 70.71,47.05 69.16,45.5 69.16,28.74 67.86,27.44 50.75,27.44 49.78,28.41 49.78,38.81 49.48,39.12 43.64,39.12 U28.104
20.3: length 114.2
  Top Layer w0.254: R30.2 87.76,7.58 87.12,8.21 87.12,43.76 84.19,46.69 70.86,46.69 69.52,45.35 69.52,28.6 68.01,27.08 50.6,27.08 49.43,28.26 49.43,35.87 48.64,36.66 41.02,36.66 U28.105
22.3: length 70.7
  Bottom Layer w0.254: U28.108 42.29,34.37 51.21,25.46 66.9,25.46 68.72,27.28 68.72,59.41 72.39,63.08 J2.12
22.4: length 73.6
  Bottom Layer w0.254: J2.10 74.42,64.6 69.08,59.26 69.08,27.12 67.06,25.1 51.06,25.1 44.71,31.45 42.23,31.45 40.84,32.85 U28.109
22.5: length 34.6
  Top Layer w0.254: U28.110 41.26,31.82 39.81,31.82 34.61,26.62 34.61,4.34 H3.8
22.6: length 29.3
  Top Layer w0.254: H3.4 36.77,4.34 36.77,27.33 U28.111
23.0: length 46.1
  Top Layer w0.254: H4.10 63.88,8.59 63.88,25.99 63.15,26.73 46.76,26.73 45.72,27.77 45.72,29.42 44.91,30.24 42.37,30.24 U28.112
CR: length 73.5
  Top Layer w0.254: U5.3 45.66,82.04 45.66,75.73 45.72,75.67 45.72,74.76 45.54,74.58 45.03,74.58 36.7,66.25 v1(36.7,30.95)
  Bottom Layer w0.254: U28.8 47.37,28.28 46.37,29.28 37.35,29.28 36.7,29.93 v1(36.7,30.95)
$1N2993: length 49.5
  Top Layer w0.254: C6.1 D3.1 24.15,57.35 C2.2 24.06,53.63 C1.2 24.06,44.73 34.25,34.54 34.25,23.87 33.87,23.49 U2.3 U2.2
$1N3021: length 2.8
  Top Layer w0.254: U2.4 31.03,24.76 R1.2
$1N3084: length 2.1
  Top Layer w0.254: C4.1 17.79,18.3 R2.2
$1N3089: length 2.7
  Top Layer w0.254: 31.18,20.91 31.14,20.95 U2.1
$1N3099: length 14.2
  Top Layer w0.254: C3.1 32.58,19.69 32.4,19.52 31.5,19.52 31.33,19.35 L1.1 23.62,18.37 22.86,19.13 22.86,20.79 U2.8
$1N3104: length 22.4
  Top Layer w0.254: C7.1 23.62,4.91 23.62,9.36 23.8,9.53 32.13,9.53 32.31,9.71 32.31,11.76 32.32,11.77 32.32,15.75 D2.2 32.17,15.91 L1.2
$1N3116: length 6.1
  Top Layer w0.254: U2.6 20.95,23.49 20.78,23.31 20.78,20.99 20.07,20.28 R2.1
$1N3207: length 1.7
  Top Layer w0.254: R4.1 R3.2
$1N3215: length 10
  Top Layer w0.254: R4.2 R5.1 17.79,26.75 17.97,26.93 20.65,26.93 21.08,26.5 21.08,24.94 21.26,24.76 U2.5
$1N3242: length 3.3
  Top Layer w0.254: R6.2 20.31,2.12 LED1.2
$1N3695: length 2.5
  Top Layer w0.254: R7.2 57.02,82.64 LED2.2
$1N4280: length 51
  Top Layer w0.254: 10.79,64.85 10.79,74.19 11.36,74.76 20.3,74.76 21.08,75.54 D1.1 20.95,76.67 21.97,77.68 v1(22.99,77.68) ; 10.79,64.85 10.79,57.48 8.85,55.54 U6.2 ; 10.79,64.85 Q1.3
  Bottom Layer w0.254: v1(22.99,77.68) 26.67,77.68 27.05,78.06 U7.3
$1N4292: length 9.7
  Top Layer w0.254: U7.1 17.78,84.03 17.78,79.21 ; R8.2 17.78,79.21 ; 17.78,79.21 20.69,79.21 D1.2
$1N4319: length 25.2
  Top Layer w0.254: Q1.1 14.12,73.26 15.11,74.25 23.5,74.25 24.64,75.4 24.64,83.14 23.62,84.16 U7.2
$1N5131: length 11.4
  Top Layer w0.254: R11.2 75.69,72.98 76.27,73.56 76.27,78.77 76.45,78.95 BUZZER1.1
$1N5132: length 18.7
  Top Layer w0.254: BUZZER1.2 88.13,81.5 86.74,82.89 Q2.3
$1N5133: length 3.2
  Top Layer w0.254: Q2.1 74.76,78.92 R12.2
$1N6075: length 8.8
  Top Layer w0.254: U21.1 92.27,13.1 91.69,12.53 91.69,10.52 R24.2 91.68,7.71 91.82,7.57
$1N6078: length 8.2
  Top Layer w0.254: U22.1 94.88,32.9 92.51,32.9 91.69,32.09 91.69,31.23 R25.2 R31.1
$1N6081: length 9.1
  Top Layer w0.254: 91.69,40.84 91.69,42.76 91.87,42.94 95.14,42.94 U23.1 ; 91.69,40.84 91.82,40.98 ; 91.69,40.84 R26.2 R32.1
$1N6084: length 8.4
  Top Layer w0.254: U24.1 92.27,52.98 91.67,52.38 R33.1 91.69,50.49 R27.2
$1N6374: length 2.7
  Top Layer w0.254: LED3.2 57.01,75.39 R34.2
$1N7088: length 3
  Top Layer w0.254: R38.2 74.68,5.8 H5.2
$1N7091: length 2.9
  Top Layer w0.254: R37.1 80.14,2.88 80.01,3.01
$1N7092: length 2.8
  Top Layer w0.254: H5.6 82.43,5.55 R36.1
$1N7095: length 3
  Top Layer w0.254: R35.2 74.8,2.88 74.93,3.01

## Copper pours and planes (outline as drawn; the poured copper is in the pictures)
GND on Top Layer: -13.97,102.83 107.82,102.83 107.82,-10.58 -13.97,-10.58
GND on Bottom Layer: -6.73,97.62 108.33,97.62 108.33,-10.71 -6.73,-10.71
VCC3V3 on Inner2: 105.03,-10.08 105.03,55.08 87.88,55.08 87.88,74.25 88.01,74.38 63.37,74.38 63.37,85.17 46.74,85.17 46.74,77.81 58.8,77.81 59.31,77.3 59.31,69.81 59.18,69.68 51.82,69.68 51.69,69.55 51.69,29.55 52.32,28.91 67.69,28.91 67.69,-9.94 104.76,-9.94 105.16,-10.33 105.16,-10.2
VCC5V on Inner2: 15.62,26.88 63.2,26.88 63.84,26.25 63.84,-4.15 62.99,-5 14.61,-5 14.48,-5.12 14.48,5.93 16.38,5.93 18.8,8.34 18.8,15.64 15.56,18.88 15.56,26.82
VCC5V on Inner2: 33.15,92.54 46.35,92.54 46.35,76.79 48.77,76.79 48.9,76.67 48.9,74.38 33.15,74.38

Small or netless copper shapes (teardrops, artwork), in the pictures only: 165 on Top Layer, 38 on Bottom Layer, 9 on Inner2

## Text on the board
Top Layer: 2026-4-30 | DZXS-承驿
